# Altium schematic sheet v1.0.SchDoc
size 88 x 63 mm
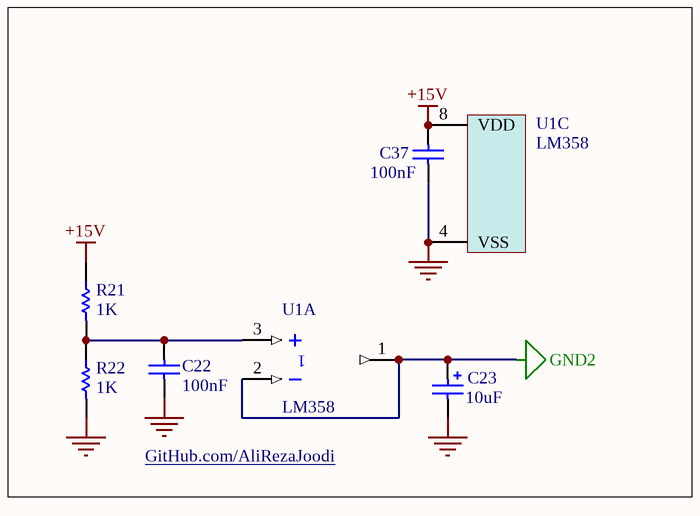
[diagram p0: v1.0.SchDoc]

## Parts
C22  100nF  [CAPNTO2.54-3.05x1.78A]
C23  10uF  [CAPPR2.5-6.3x5]
C37  100nF  [CAPNTO2.54-3.05x1.78A]
R21  1K  [AXIAL-0.4]
R22  1K  [AXIAL-0.4]
U1  LM358  [DIP8]  (parts A,C of 3)

## Nets
+15V: C37.2 R21.1 U1.8(VDD)
GND: C22.1 C23.2 C37.1 R22.2 U1.4(VSS)
GND2: C23.1 U1.1(OUT) U1.2(IN-)
NetC22_2: C22.2 R21.2 R22.1 U1.3(IN+)

## Notes on the sheet
- GitHub.com/AliRezaJoodi

## Library data of the parts
C22 C37 = Cap: Capacitor; Manufacturer: Generic Components; Class I: Passive; Published: 8-Jun-2000; Revision: July-2002: Re-released for DXP Platform.; Publisher: Altium Limited; Class II: Capacitor
C23 = Cap Pol1: Polarized Capacitor (Radial); Manufacturer: Generic Components; Class I: Passive; Published: 8-Jun-2000; Revision: July-2002: Re-released for DXP Platform.; Publisher: Altium Limited; Class II: Capacitor
R21 R22 = Res1: Resistor; Published: 8-Jun-2000; LatestRevisionDate: 17-Jul-2002; LatestRevisionNote: Re-released for DXP Platform.; PackageReference: AXIAL-0.3; Publisher: Altium Limited
U1 = LM358: Dual Low-Power Operational Amplifier; Published: 17-Jul-2002; LatestRevisionDate: 13-Apr-2006; LatestRevisionNote: IPC-7351 Footprint Added.; DatasheetVersion: 1988; PackageReference: 751-02; Publisher: Altium Limited; PackageDescription: 8-Pin Small Outline Integrated Circuit 1.27 mm Pitch; Code_JEDEC: MS-012-AA; Code_IPC: SOIC127P600-8; ComponentLink1Description: Manufacturer Link; ComponentLink1URL: http://www.onsemi.com/site/products/parametrics/0,4446,251,00.html; ComponentLink2Description: Datasheet; ComponentLink2URL: http://www.onsemi.com/pub/Collateral/LM358-D.PDF